# EAGLE design caffeine-hardware (EAGLE 7.7.0)
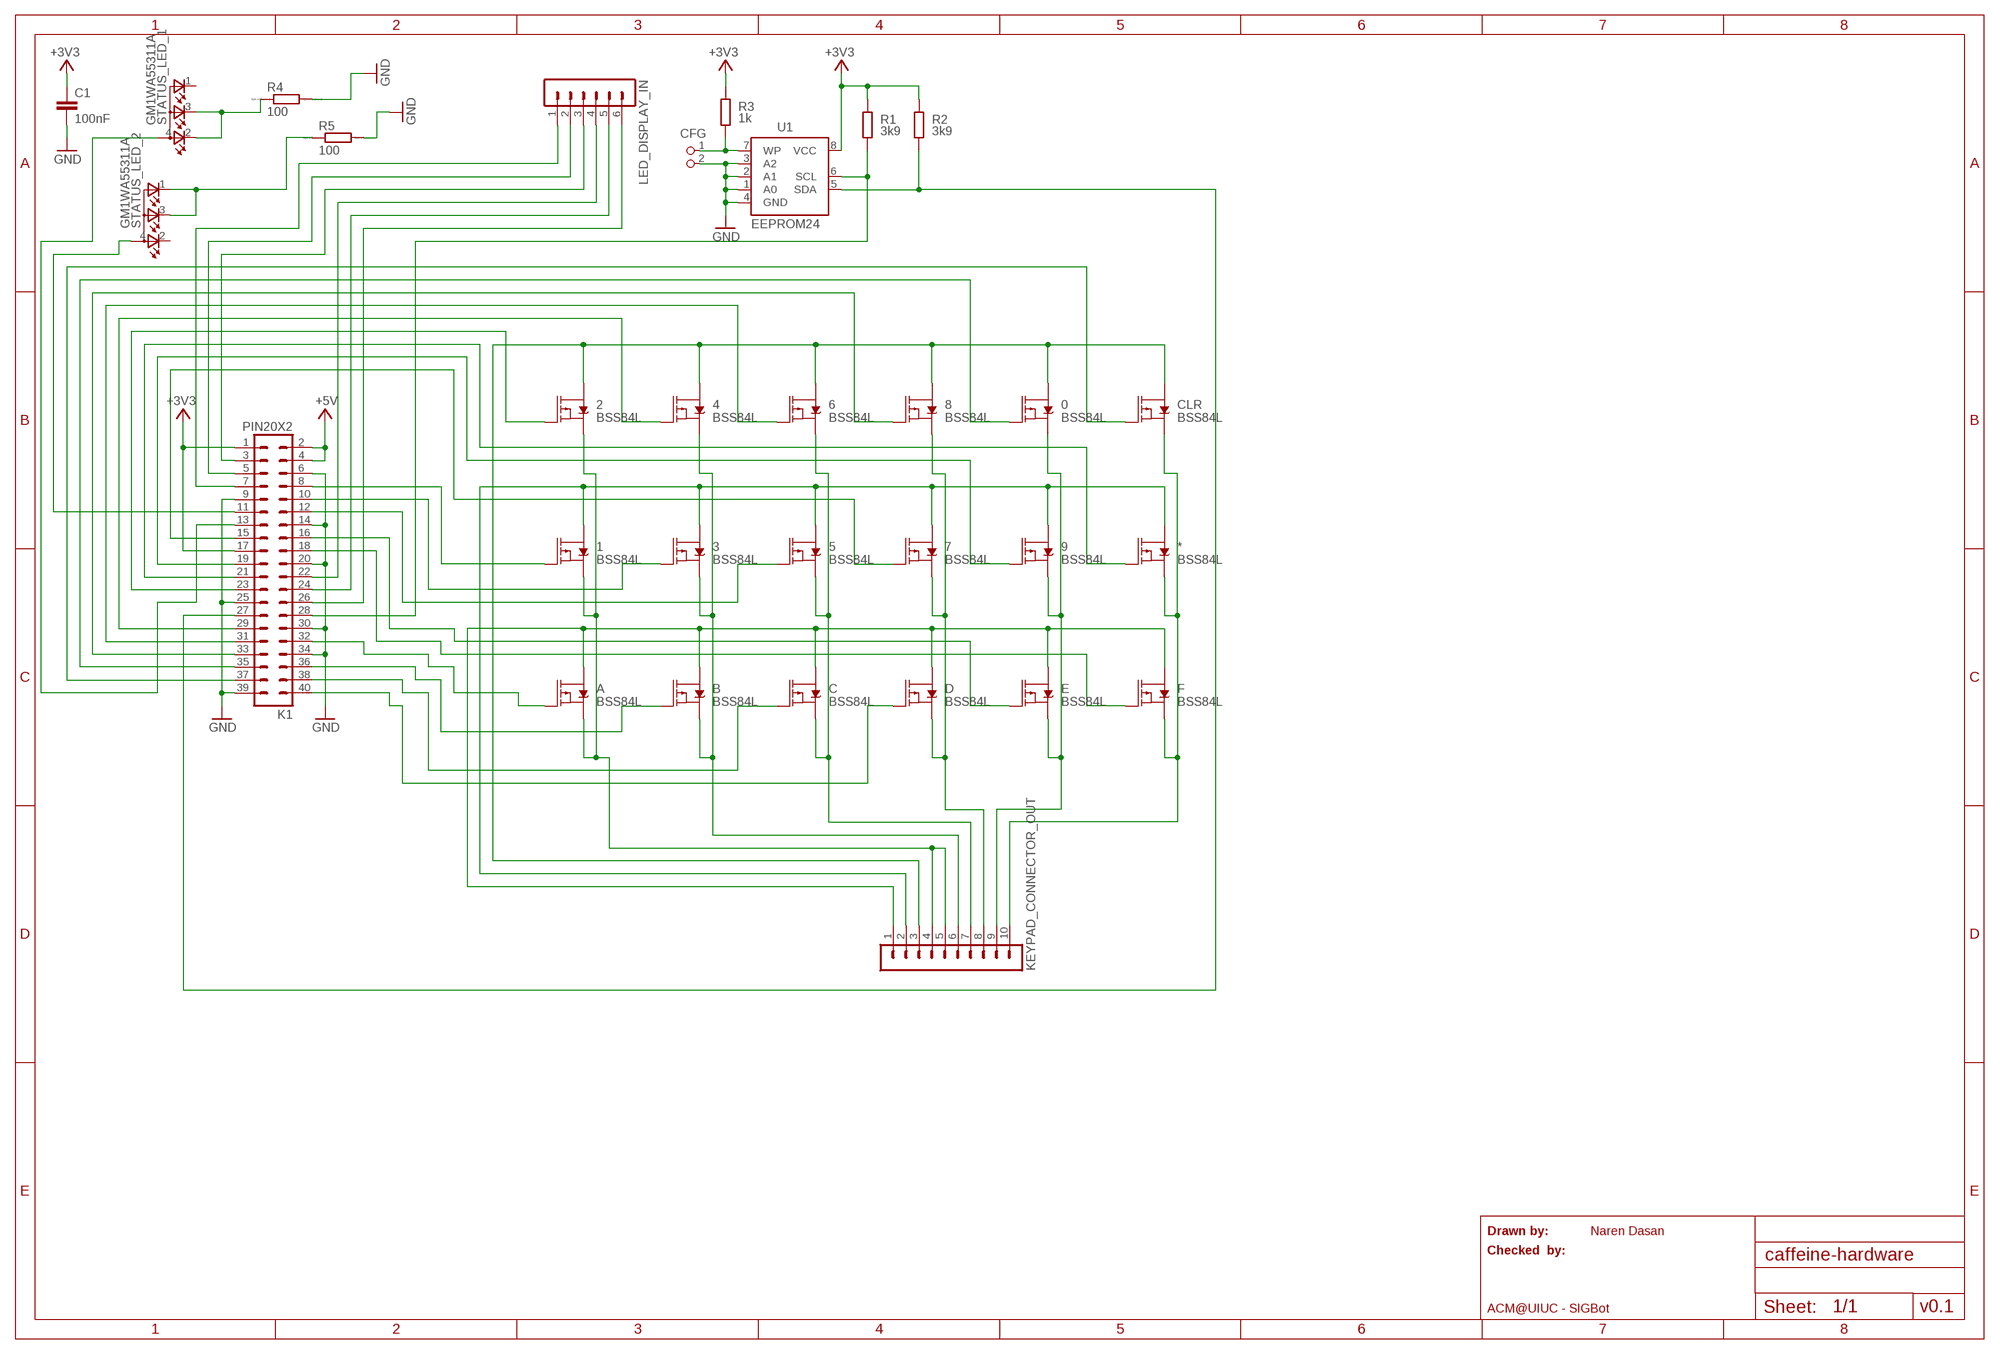
[diagram p0: schematic, sheet 1]

## Parts
0  BSS84L  MOSFET-PCH-SI2309DS  [SOT23-3]
1  BSS84L  MOSFET-PCH-SI2309DS  [SOT23-3]
2  BSS84L  MOSFET-PCH-SI2309DS  [SOT23-3]
3  BSS84L  MOSFET-PCH-SI2309DS  [SOT23-3]
4  BSS84L  MOSFET-PCH-SI2309DS  [SOT23-3]
5  BSS84L  MOSFET-PCH-SI2309DS  [SOT23-3]
6  BSS84L  MOSFET-PCH-SI2309DS  [SOT23-3]
7  BSS84L  MOSFET-PCH-SI2309DS  [SOT23-3]
8  BSS84L  MOSFET-PCH-SI2309DS  [SOT23-3]
9  BSS84L  MOSFET-PCH-SI2309DS  [SOT23-3]
*  BSS84L  MOSFET-PCH-SI2309DS  [SOT23-3]
A  BSS84L  MOSFET-PCH-SI2309DS  [SOT23-3]
B  BSS84L  MOSFET-PCH-SI2309DS  [SOT23-3]
C  BSS84L  MOSFET-PCH-SI2309DS  [SOT23-3]
C1  100nF  C-EUC0805K  [C0805K]
CFG  PIN2_100  [PIN_W_2]
CLR  BSS84L  MOSFET-PCH-SI2309DS  [SOT23-3]
D  BSS84L  MOSFET-PCH-SI2309DS  [SOT23-3]
E  BSS84L  MOSFET-PCH-SI2309DS  [SOT23-3]
F  BSS84L  MOSFET-PCH-SI2309DS  [SOT23-3]
K1  PIN20X2  [PIN_20X2]
KEYPAD_CONNECTOR_OUT  MA10-1  [MA10-1]
LED_DISPLAY_IN  MA06-1  [MA06-1]
R1  3k9  R-EU_M0805  [M0805]
R2  3k9  R-EU_M0805  [M0805]
R3  1k  R-EU_M0805  [M0805]
R4  100  R  [R0805]
R5  100  R  [R0805]
STATUS_LED_1  GM1WA55311A  [GM1WA55311A]
STATUS_LED_2  GM1WA55311A  [GM1WA55311A]
U1  EEPROM24  [SOIC8]

## Nets
+3V3: C1.1 K1.1 K1.17 R1.2 R2.2 R3.2 U1.8(VCC)
+5V: K1.2 K1.4
GND: C1.2 CFG.2 K1.6 K1.9 K1.14 K1.20 K1.25 K1.30 K1.34 K1.39 R4.2 R5.2 U1.1(A0) U1.2(A1) U1.3(A2) U1.4(GND)
N$1: K1.28 R1.1 U1.6(SCL)
N$2: K1.27 R2.1 U1.5(SDA)
N$3: CFG.1 R3.1 U1.7(WP)
N$4: A.3(D) B.3(D) C.3(D) D.3(D) E.3(D) F.3(D) KEYPAD_CONNECTOR_OUT.1
N$5: 1.3(D) 3.3(D) 5.3(D) 7.3(D) 9.3(D) *.3(D) KEYPAD_CONNECTOR_OUT.2
N$6: 0.3(D) 2.3(D) 4.3(D) 6.3(D) 8.3(D) CLR.3(D) KEYPAD_CONNECTOR_OUT.3
N$7: 5.2(S) 6.2(S) C.2(S) KEYPAD_CONNECTOR_OUT.7
N$8: CLR.1(G) K1.37
N$9: 1.2(S) 2.2(S) A.2(S) KEYPAD_CONNECTOR_OUT.4 KEYPAD_CONNECTOR_OUT.5
N$10: 7.2(S) 8.2(S) D.2(S) KEYPAD_CONNECTOR_OUT.8
N$11: 0.2(S) 9.2(S) E.2(S) KEYPAD_CONNECTOR_OUT.9
N$12: *.2(S) CLR.2(S) F.2(S) KEYPAD_CONNECTOR_OUT.10
N$13: 3.2(S) 4.2(S) B.2(S) KEYPAD_CONNECTOR_OUT.6
N$14: 0.1(G) K1.35
N$15: 8.1(G) K1.33
N$16: 6.1(G) K1.31
N$17: 4.1(G) K1.29
N$18: 2.1(G) K1.23
N$19: 7.1(G) K1.15
N$20: *.1(G) K1.21
N$21: 9.1(G) K1.19
N$22: 1.1(G) K1.8
N$23: 3.1(G) K1.10
N$24: 5.1(G) K1.12
N$25: F.1(G) K1.18
N$26: E.1(G) K1.16
N$27: A.1(G) K1.32
N$28: B.1(G) K1.36
N$29: C.1(G) K1.38
N$30: D.1(G) K1.40
N$31: K1.7 LED_DISPLAY_IN.1
N$32: K1.5 LED_DISPLAY_IN.2
N$33: K1.22 LED_DISPLAY_IN.4
N$34: K1.3 LED_DISPLAY_IN.3
N$35: K1.26 LED_DISPLAY_IN.6
N$36: K1.24 LED_DISPLAY_IN.5
N$37: K1.11 STATUS_LED_2.4(A)
N$38: K1.13 STATUS_LED_1.4(A)
N$41: R4.1 STATUS_LED_1.2(CRED) STATUS_LED_1.3(CBLUE)
N$42: R5.1 STATUS_LED_2.1(CGREEN) STATUS_LED_2.3(CBLUE)
Unconnected: STATUS_LED_1.1(CGREEN) STATUS_LED_2.2(CRED)

## Notes on the sheet
- Drawn by: | Naren Dasan
- Checked  by:
- ACM@UIUC - SIGBot | v0.1

## Library data of the parts
0 1-9 * A B C CLR D E F = SparkFun-DiscreteSemi:MOSFET-PCH: P-channel MOSFETs Voltage controlled devices that allow control of high current outputs.; PROD_ID: TRANS-08285; VALUE: 1.1A/60V/600mΩ
C1 = resistor:C-EU: CAPACITOR, European symbol; DIELECTRIC: X7R
CFG = FLYFISH:PIN2
K1 = FLYFISH:PIN20X2
KEYPAD_CONNECTOR_OUT = con-lstb:MA10-1: PIN HEADER; OC_FARNELL: unknown; OC_NEWARK: unknown
LED_DISPLAY_IN = con-lstb:MA06-1: PIN HEADER; OC_FARNELL: unknown; OC_NEWARK: unknown
R1-R3 = resistor:R-EU_: RESISTOR, European symbol; TOLERANCE: 5%
R4 R5 = eagle-ltspice:R: RESISTOR, European symbol; SPICEMODEL: NONE; SPICEPREFIX: R
STATUS_LED_1 STATUS_LED_2 = led:GM1WA55311A: Chip LED RGB Source: http://document.sharpsma.com/files/GM1WA55311A_SS.pdf
U1 = FLYFISH:EEPROM24

## Board
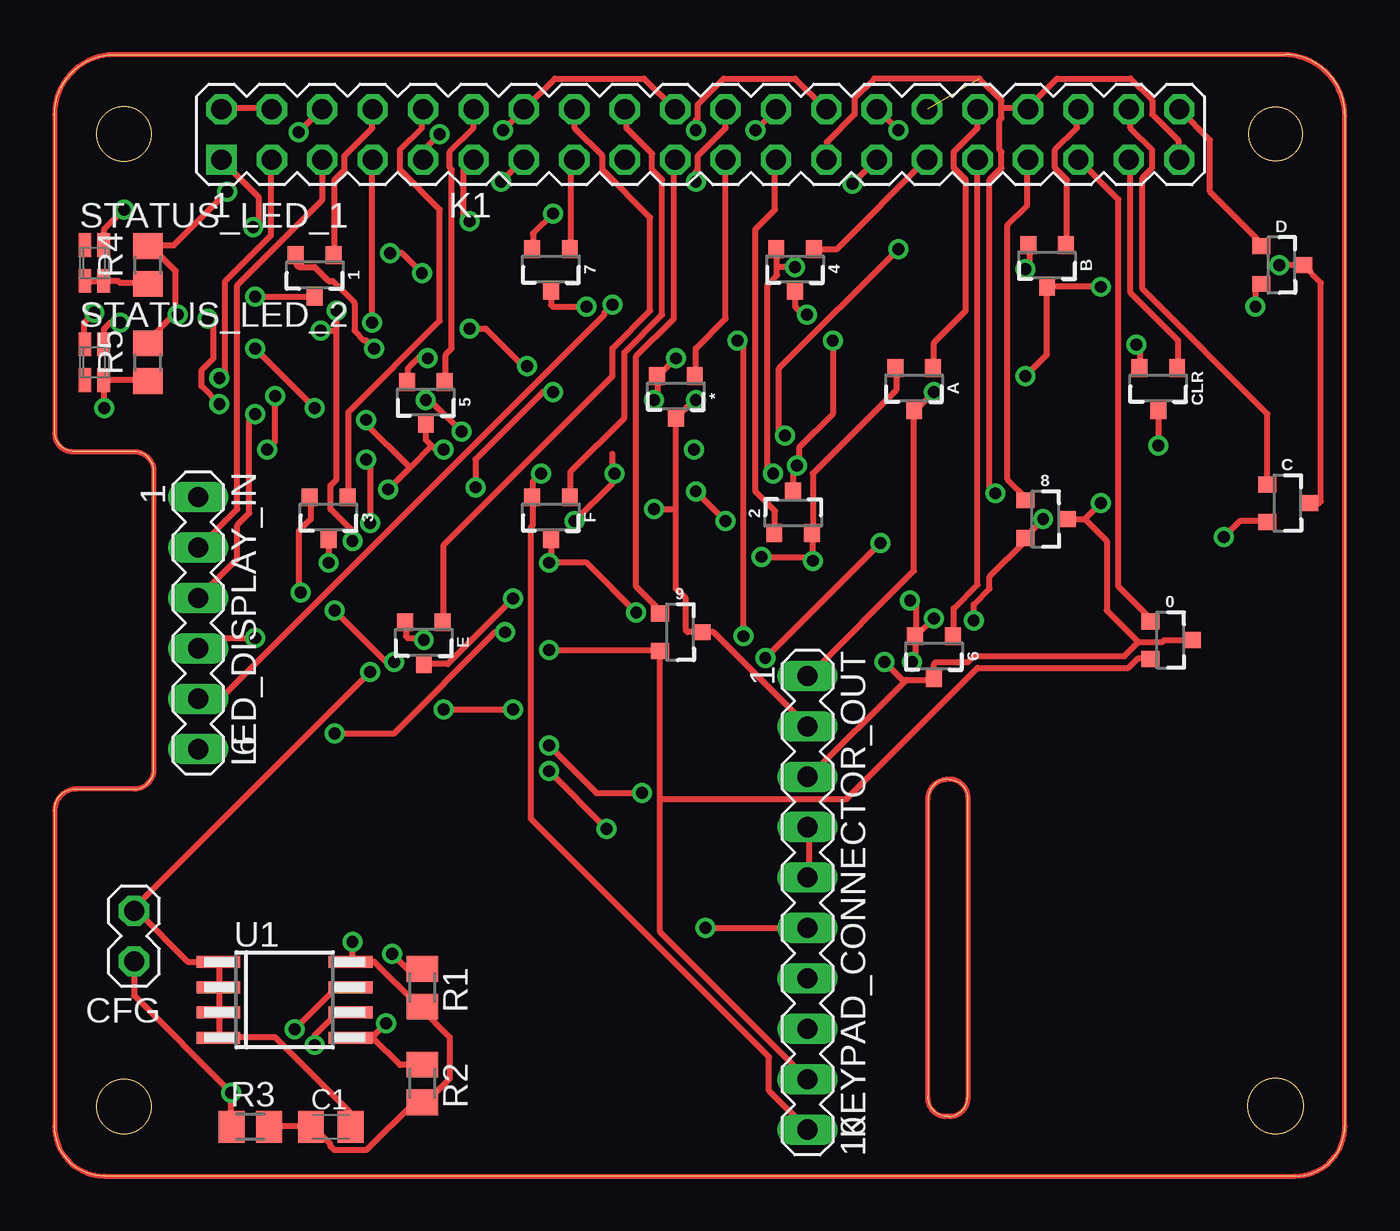
[diagram p1: board, top side]
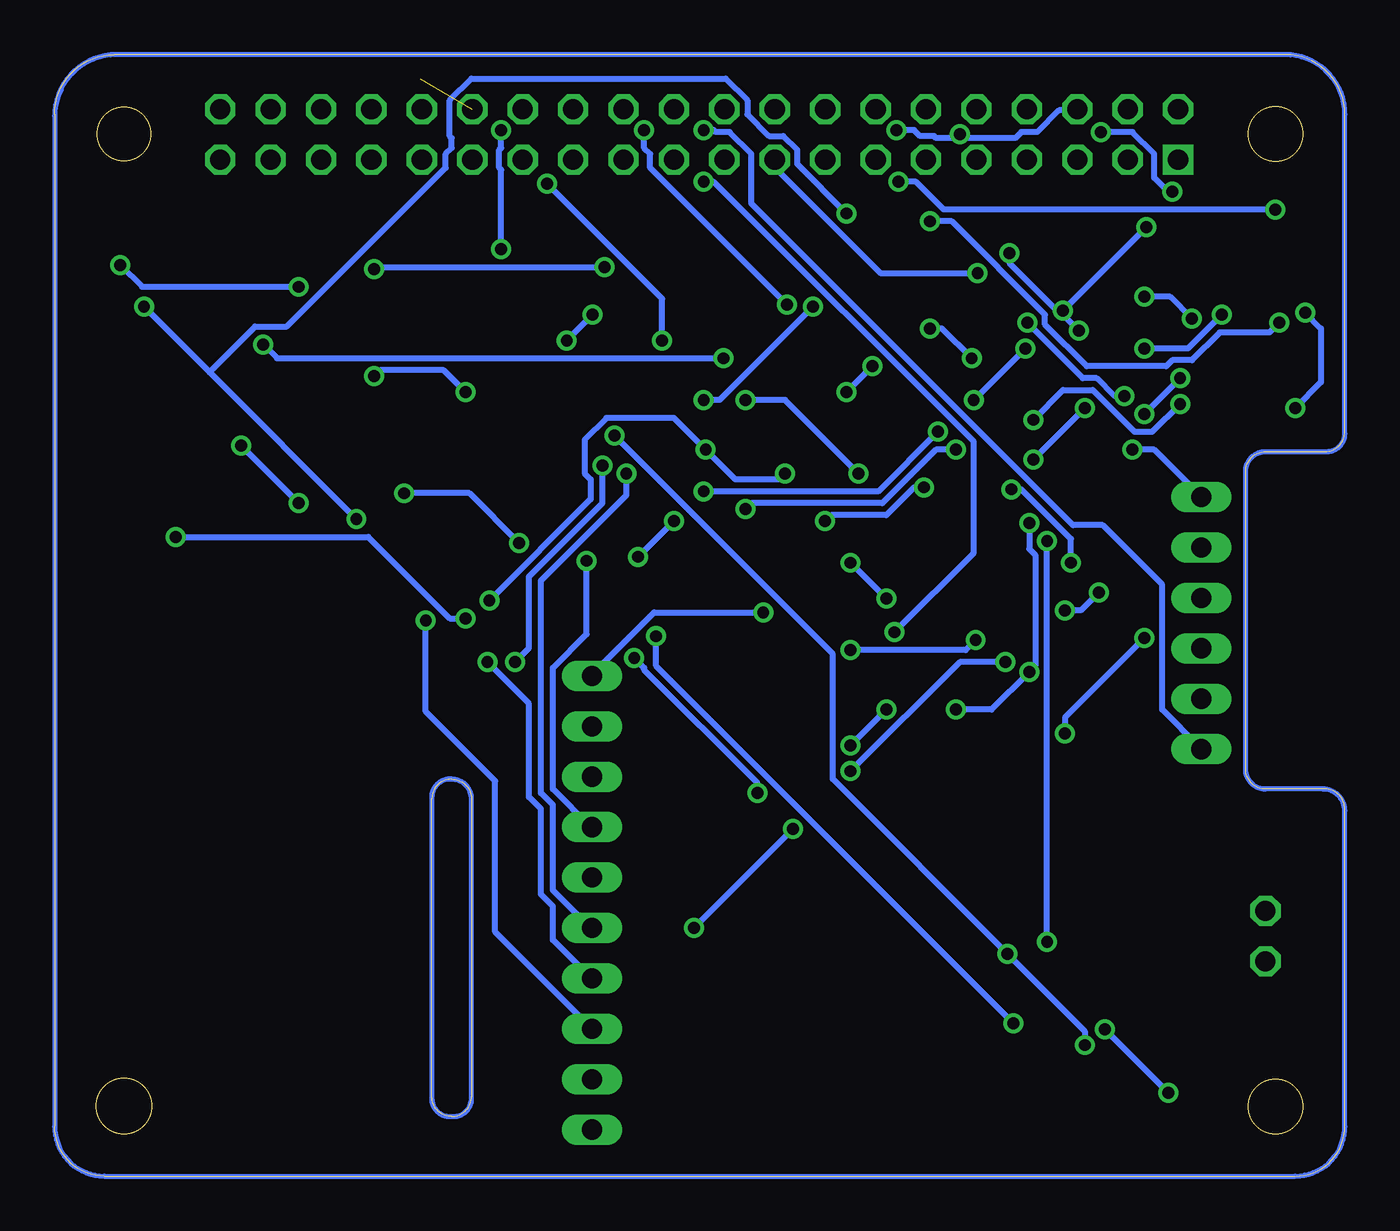
[diagram p2: board, bottom side, seen from below]

Size 65 x 56.5 mm. Coordinates in mm from the lower left corner, seen from the top.
Outline: 3,56.5 62,56.5 arc-90 65,53.5 65,2.5 arc-90 62.5,0 2.5,0 arc-90 0,2.5 0,18.5 arc-90 1,19.5 4,19.5 arc90 5,20.5 5,35.5 arc90 4,36.5 1,36.5 arc-90 0,37.5 0,53.5 arc-90 3,56.5
Outline: 46,4 46,19 arc90 45,20 arc90 44,19 44,4 arc90 45,3 arc90 46,4
Outline: circle at 3.5,3.5 radius 1.38
Outline: circle at 61.5,3.52 radius 1.4
Outline: circle at 3.5,52.5 radius 1.38
Outline: circle at 61.5,52.5 radius 1.35
Copper layers (1*16): Top 0.035mm / dielectric 1.5mm / Bottom 0.035mm
Design rules "default": minimum track width 10mil, minimum drill 24mil, track to track 8mil, track to pad 8mil, pad to pad 8mil, via to via 8mil, smd to smd 8mil, copper to edge 40mil, drill to drill 8mil, minimum pad ring 10mil, minimum via ring 8mil, stop-mask expansion 4mil, vias tented up to drill 0mil, thermal gap 10mil
tRestrict: area 0.4,0.4 to 6.6,6.6; area 0.4,49.4 to 6.6,55.6; area 58.4,49.4 to 64.6,55.6; area 58.4,0.4 to 64.6,6.6
bRestrict: area 0.4,0.4 to 6.6,6.6; area 58.4,0.4 to 64.6,6.6; area 0.4,49.4 to 6.6,55.6; area 58.4,49.4 to 64.6,55.6

### Footprints (pad centres in the part's own frame; a part is rotated, then mirrored left to right if it is on the bottom)
SOT23-3 = smd 0.8 x 0.9: 1 -0.95,-1; 2 0.95,-1; 3 0,1.1
C0805K = smd 1.3 x 1.6: 1 -1,0; 2 1,0
PIN_W_2 = drill 1.016 octagon: 1 0,0; 2 0,-2.54
PIN_20X2 = drill 1.016 square: 1 -24.13,-1.27 | drill 1.016 octagon: 2 -24.13,1.27; 3 -21.59,-1.27; 4 -21.59,1.27; 5 -19.05,-1.27; 6 -19.05,1.27; 7 -16.51,-1.27; 8 -16.51,1.27; 9 -13.97,-1.27; 10 -13.97,1.27; 11 -11.43,-1.27; 12 -11.43,1.27; 13 -8.89,-1.27; 14 -8.89,1.27; 15 -6.35,-1.27; 16 -6.35,1.27; 17 -3.81,-1.27; 18 -3.81,1.27; 19 -1.27,-1.27; 20 -1.27,1.27; 21 1.27,-1.27; 22 1.27,1.27; 23 3.81,-1.27; 24 3.81,1.27; 25 6.35,-1.27; 26 6.35,1.27; 27 8.89,-1.27; 28 8.89,1.27; 29 11.43,-1.27; 30 11.43,1.27; 31 13.97,-1.27; 32 13.97,1.27; 33 16.51,-1.27; 34 16.51,1.27; 35 19.05,-1.27; 36 19.05,1.27; 37 21.59,-1.27; 38 21.59,1.27; 39 24.13,-1.27; 40 24.13,1.27
MA10-1 = drill 1.016 long: 1 -11.43,0; 2 -8.89,0; 3 -6.35,0; 4 -3.81,0; 5 -1.27,0; 6 1.27,0; 7 3.81,0; 8 6.35,0; 9 8.89,0; 10 11.43,0
MA06-1 = drill 1.016 long: 1 -6.35,0; 2 -3.81,0; 3 -1.27,0; 4 1.27,0; 5 3.81,0; 6 6.35,0
M0805 = smd 1.3 x 1.6: 1 -0.95,0; 2 0.95,0
R0805 = smd 1.3 x 1.5: 1 -0.95,0; 2 0.95,0
GM1WA55311A = smd 0.65 x 1.2: 1 -0.475,0.9; 2 -0.475,-0.9; 3 0.475,-0.9; 4 0.475,0.9
SOIC8 = smd 0.6 x 2.2: 1 -1.905,-3.33; 2 -0.635,-3.33; 3 0.635,-3.33; 4 1.905,-3.33; 5 1.905,3.33; 6 0.635,3.33; 7 -0.635,3.33; 8 -1.905,3.33

### Placement (x,y rotation side)
0  56.2,27 270 top
1  13.1,45.4 180 top
2  37.2,33.4 0 top
3  13.8,33.2 180 top
4  37.3,45.7 180 top
5  18.7,39 180 top
6  44.3,26.2 180 top
7  25,45.7 180 top
8  49.9,33.1 270 top
9  31.5,27.4 270 top
*  31.3,39.3 180 top
A  43.3,39.7 180 top
B  50,45.9 180 top
C  62.1,33.9 270 top
C1  13.91,2.48 0 top
CFG  4,10.82 180 top
CLR  55.6,39.7 180 top
D  61.8,45.9 270 top
E  18.6,26.9 180 top
F  25,33.2 180 top
K1  32.53,52.48 0 top
KEYPAD_CONNECTOR_OUT  37.93,13.77 270 top
LED_DISPLAY_IN  7.23,27.86 270 top
R1  18.53,9.49 270 top
R2  18.53,4.67 270 top
R3  9.86,2.48 0 top
R4  4.7,45.9 90 top
R5  4.7,41 90 top
STATUS_LED_1  2,46 0 top
STATUS_LED_2  2,41 0 top
U1  11.58,8.88 270 top

### Tracks (layer width: path | path; a pad name or v marks a point on that pad's centre or on a via)
+3V3  (via drill 0.6)
  Top 0.305: R3.2 10.9,2.5 12.8,2.5 12.9,2.6 13,2.5 C1.1 13.1,2.4 13.9,1.6 13.9,1.5 14.1,1.3 15.7,1.3 18.1,3.7 18.5,3.7 R2.2 18.6,3.7 18.7,3.7 19.9,4.9 19.9,7 18.4,8.5 18.5,8.6 R1.2 18.3,8.6 16.1,10.8 15,10.8 U1.8 15,10.9 v15,11.8 | v10,47.8 10.3,48.1 10.3,49.3 K1.1 | 14.2,42.6 14.2,35.1 13.9,34.8 13.9,33.6 15,32.5 v15,32 | 14.2,42.6 v14.2,43.6 | v13.4,42.6 14.2,42.6 | v16.9,46.5 17.5,46.5 v18.5,45.5
  Bottom 0.305: v14.2,43.6 v10,47.8 | v15,11.8 v15,32 | v13.4,42.6 14.2,43.4 14.3,43.4 16.9,46 v16.9,46.5 | v18.5,45.5 23.4,45.5 28.7,50.8 28.7,51.2 K1.17
+5V
  Top 0.305: K1.2 8.4,53.8 10.9,53.8 K1.4
GND  (via drill 0.6)  (1 unrouted)
  Top 0.305: C1.2 14.9,2.5 14.9,3.2 11.1,7 8.4,7 U1.4 8.3,7 8.3,8.1 U1.3 8.3,8.3 8.3,9.4 U1.2 8.3,9.6 8.3,10.7 U1.1 8.2,10.8 6.7,10.8 4.2,13.3 4,13.3 CFG.2 4,13.5 v15.9,25.4 | 6.1,43.5 6.1,45.6 4.8,46.9 4.7,46.9 R4.2 5,46.9 6,46.9 v8.7,49.6 | 6.1,43.5 4.6,42 4.7,41.9 R5.2 | v12.3,52.6 13.4,53.7 K1.6 | v15.9,32.9 15.9,35.9 v15.7,36.1 | v10.1,41.7 v13.1,38.7 | v6.2,43.4 6.1,43.5 | v19.4,52.5 18.6,51.7 18.6,51.3 K1.9 | v22.6,52.7 23.6,53.7 K1.14 23.7,53.8 25.2,55.3 29.7,55.3 31.2,53.8 K1.20 | 47.7,53.8 47.7,53.3 47.6,53.2 47.6,51.7 47.7,51.6 47.7,50.8 47.1,50.2 47.1,34.7 v47.4,34.4 | 47.7,53.8 47.7,54.2 46.6,55.3 41.3,55.3 40.3,54.3 40.3,53.5 38.9,52.1 38.9,51.3 K1.25 | v35.8,26.1 v41.6,31.9 | v29.6,19.3 27.3,19.3 v24.9,21.7 | v19.6,23.5 v23.1,23.5 | 47.7,53.8 49,53.8 K1.34 49.1,53.9 50.5,55.3 54.2,55.3 55.3,54.2 55.3,53.5 56.6,52.2 56.6,51.3 K1.39
  Bottom 0.305: v12.3,52.6 10.7,52.6 9.6,51.5 9.6,50.3 8.9,49.6 v8.7,49.6 | v15.9,32.9 15.9,31.6 15.6,31.3 15.6,25.7 v15.9,25.4 17.8,23.5 v19.6,23.5 | v13.1,38.7 v15.7,36.1 | v10.1,41.7 7.9,41.7 v6.2,43.4 | K1.6 13.5,53.7 14.4,53.7 15.5,52.6 16.3,52.6 16.6,52.3 19.2,52.3 v19.4,52.5 19.6,52.3 20.6,52.3 20.7,52.4 21.4,52.4 21.7,52.7 v22.6,52.7 | v47.4,34.4 44.1,34.4 v41.6,31.9 | v35.8,26.1 35.3,25.6 35.3,25.5 29.6,19.8 v29.6,19.3 | v23.1,23.5 v24.9,21.7
N$1  (via drill 0.6)
  Top 0.305: v13.1,6.6 13.1,7.1 14.2,8.2 14.9,8.2 U1.6 | v17,11.2 17.8,10.4 18.5,10.4 R1.1 | v42.5,52.7 41.5,53.7 K1.28 | v42.5,46.7 36.5,40.7 36.5,37.6 v36.8,37.3
  Bottom 0.305: v13.1,6.6 13.1,7.3 v17,11.2 25.8,20 25.8,26.3 v36.8,37.3 | v42.5,52.7 42.5,51.8 42.6,51.7 42.6,50.8 42.5,50.7 v42.5,46.7
N$2  (via drill 0.6)
  Top 0.305: 16,7 15,7 U1.5 | 16,7 17.4,5.6 18.5,5.6 R2.1 | v40.2,50 41.4,51.2 K1.27 | v34.4,42.1 34.7,41.8 v34.7,27.2 | 16,7 v16.7,7.7
  Bottom 0.305: v40.2,50 34.4,44.2 v34.4,42.1 | v34.7,27.2 34.7,25.7 v16.7,7.7
N$3  (via drill 0.6)
  Top 0.305: v12.1,7.4 14.2,9.5 14.9,9.5 U1.7 | R3.1 8.9,2.5 v8.9,4.2 4,9.1 CFG.1
  Bottom 0.305: v8.9,4.2 v12.1,7.4
N$4  (via drill 0.6)
  Top 0.305: C.3 63.7,33.9 63.8,34 63.8,45 D.3 v61.7,45.9 | v52.7,44.8 B.3 50,41.4 v48.9,40.3 | KEYPAD_CONNECTOR_OUT.1 38,25.2 43.3,30.5 A.3 43.4,38.6 v44.3,39.5 | E.3 19.8,25.8 v23.1,29.1 | F.3 25,31 v24.9,30.9 26.8,30.9 v29.3,28.4
  Bottom 0.305: v52.7,44.8 60.6,44.8 v61.7,45.9 | v48.9,40.3 48.6,40.6 45.4,40.6 v44.3,39.5 | v24.9,30.9 v23.1,29.1 | v29.3,28.4 34.8,28.4 38,25.2 KEYPAD_CONNECTOR_OUT.1
N$5  (via drill 0.6)
  Top 0.305: 31.3,33.6 31.3,29.6 31.8,29.1 31.8,27.5 31.9,27.4 9.3 33.2,27.4 37.9,22.7 KEYPAD_CONNECTOR_OUT.2 | 31.3,33.6 *.3 32.2,39.1 v32.3,39.1 | v26.8,43.8 25.1,43.8 25,43.9 7.3 | v30.2,33.6 31.3,33.6 | v19.6,36.6 19.2,36.6 19,36.8 | 19,36.8 18.7,37.1 5.3 | v16.8,34.6 17.9,35.7 | 17.9,35.7 19,36.8 | 3.3 v13.8,30.9 | 17.9,35.7 15.6,38 | 15.6,38 15.5,38.1 | v10.1,44.3 1.3 | v7.7,43.2 8,42.9 8,41.2 7.4,40.6 7.4,39.8 v8.3,38.9 | v15.7,38.1 15.6,38
  Bottom 0.305: v32.3,39.1 31.5,39.1 v26.8,43.8 | v30.2,33.6 29.9,33.9 23.3,33.9 20.6,36.6 v19.6,36.6 | v16.8,34.6 16.3,34.6 3.3 v13.8,30.9 | v10.1,44.3 8.8,44.3 v7.7,43.2 | v8.3,38.9 9.7,37.5 10.6,37.5 12.7,39.6 14.2,39.6 v15.7,38.1
N$6  (via drill 0.6)
  Top 0.305: 0.3 55.9,27 55.8,26.9 54.6,26.9 | 54.6,26.9 53.9,26.2 46.3,26.2 46,25.9 44.4,25.9 44.3,25.8 6.3 44.2,25 42.9,25 42.8,24.9 | 54.6,26.9 53,28.5 53,32 51.9,33.1 | 8.3 51.9,33.1 | v52.7,33.9 51.9,33.1 | CLR.3 v55.6,36.8 | 42.8,24.9 38,20.1 KEYPAD_CONNECTOR_OUT.3 | 2.3 37.2,35.6 v37.4,35.8 37.5,35.9 37.5,36.7 39.2,38.4 v39.2,42.1 | 42.8,24.9 v41.8,25.9 | v37.9,43.4 37.7,43.4 37.3,43.8 4.3
  Bottom 0.305: v55.6,36.8 v52.7,33.9 | v37.4,35.8 37.4,33.9 41.1,30.2 41.1,26.6 v41.8,25.9 | v37.9,43.4 v39.2,42.1
N$7  (via drill 0.6)
  Top 0.305: v43.2,25.9 43.4,26.1 43.4,27.2 6.2 | v44.3,28.1 43.5,27.3 6.2 | v58.9,32.2 59.7,33 61.1,33 C.2 | 5.2 17.8,40 17.8,40.7 18.4,41.3 18.8,41.3 v18.8,41.2 | v20.9,42.7 21.7,42.7 23.7,40.7 23.8,40.7 | 23.8,40.7 23.9,40.7 | v23.8,40.8 23.8,40.7 | 28.1,35.4 28.1,34.9 v26.2,33 | 28.1,35.4 28.1,36.4 | v21.2,34.7 21.2,36.1 24.6,39.5 v25.1,39.5 | v32.2,36.6 32.5,36.6 | v28.2,35.4 28.1,35.4 | v43.1,29 43.4,28.7 43.4,27.6 43.5,27.5 6.2
  Bottom 0.305: v43.2,25.9 41.1,23.8 41.1,19.1 40.5,18.5 40.5,14.2 39.9,13.6 39.9,11.9 38,10 KEYPAD_CONNECTOR_OUT.7 | v44.3,28.1 45.1,28.1 49.2,32.2 v58.9,32.2 | v20.9,42.7 20.3,42.7 v18.8,41.2 | v23.8,40.8 v25.1,39.5 | v26.2,33 25.9,33.3 23.1,33.3 21.7,34.7 v21.2,34.7 | v28.2,35.4 28.5,35.1 30.7,35.1 v32.2,36.6 33.8,38.2 37.2,38.2 38.3,37.1 38.3,35.4 38,35.1 38,34.1 v43.1,29
N$8
  Top 0.305: K1.37 54.2,51.2 54.2,44.5 56.6,42.1 56.6,40.7 CLR.1
N$9  (via drill 0.6)
  Top 0.305: KEYPAD_CONNECTOR_OUT.5 38,15.1 38,17.5 KEYPAD_CONNECTOR_OUT.4 | A.2 42.4,40.7 42.4,39.6 38.2,35.4 38.2,32.5 2.2 38.2,32.4 v38.2,31 38.1,31.2 v35.6,31.2 | v32.3,34.5 v33.8,33 | v20.5,37.5 18.9,39.1 v18.7,39.1 | v16.1,41.7 15.7,42.1 15.6,42.1 15.1,42.6 15.1,44 14,45.1 13.8,45.1 13.1,45.8 12.3,45.8 12.2,45.9 12.2,46.4 1.2
  Bottom 0.305: v38.2,31 38.2,27.3 39.9,25.6 39.9,19.5 38,17.6 KEYPAD_CONNECTOR_OUT.4 | v33.8,33 v35.6,31.2 | v32.3,34.5 23.5,34.5 v20.5,37.5 | v16.1,41.7 v18.7,39.1
N$10  (via drill 0.6)
  Top 0.305: v49.8,33.1 48.9,32.2 8.2 48.9,32 47.1,30.2 47.1,29.6 46.3,28.8 v46.3,28 | v60.5,43.8 60.5,44.6 60.8,44.9 D.2 | v25.1,48.5 24.1,47.5 24.1,46.7 7.2
  Bottom 0.305: v60.5,43.8 57.2,40.5 | 57.2,40.5 v49.8,33.1 | v46.3,28 46.3,23.4 42.8,19.9 42.8,12.3 38,7.5 KEYPAD_CONNECTOR_OUT.8 | v25.1,48.5 27.6,51 27.6,51.7 28.3,52.4 29,52.4 30.1,53.5 30.1,54.2 31.2,55.3 44,55.3 45.1,54.2 45.1,52.4 45,52.3 45,51.8 45.3,51.5 45.3,50.8 53.3,42.8 54.9,42.8 57.2,40.5
N$11  (via drill 0.6)
  Top 0.305: 30.5,19 30.5,12.3 37.9,4.9 KEYPAD_CONNECTOR_OUT.9 | 30.5,19 9.2 30.4,26.5 v24.9,26.5 | v18.6,27 18.5,27.1 17.8,27.1 17.7,27.2 17.7,27.9 E.2 | 30.5,19 39.9,19 46.5,25.6 54.1,25.6 54.6,26.1 55.2,26.1 0.2
  Bottom 0.305: v24.9,26.5 19.1,26.5 v18.6,27
N$12  (via drill 0.6)
  Top 0.305: v30.2,39.1 30.4,39.3 30.4,40.3 *.2 30.5,40.4 v31.3,41.2 | v24.5,35.4 24.1,35 24.1,34.2 F.2 24.1,34.1 24.1,32.8 24,32.7 24,18 36,6 36,4.3 37.9,2.4 KEYPAD_CONNECTOR_OUT.10 | v54.5,41.9 54.7,41.7 54.7,40.7 CLR.2
  Bottom 0.305: v30.2,39.1 28.2,39.1 v24.5,35.4 | v31.3,41.2 53.8,41.2 v54.5,41.9
N$13  (via drill 0.6)
  Top 0.305: 36.4,45.8 36.4,45.4 35.9,44.9 35.9,35.7 v36.2,35.4 | 36.4,45.8 36.4,46.7 4.2 | v37.3,45.8 36.4,45.8 | v48.9,45.7 49.1,45.9 49.1,46.9 B.2 | 12.3,29.4 12.3,32.5 12.9,33.1 12.9,34.2 3.2 | 12.3,29.4 12.3,29.2 | v32.8,12.5 KEYPAD_CONNECTOR_OUT.6 | v24.9,20.4 v27.8,17.5 | v17.1,25.9 16.7,25.9 v14.1,28.5 | v12.4,29.4 12.3,29.4
  Bottom 0.305: v36.2,35.4 36.2,34.3 40.5,30 40.5,19.3 39.9,18.7 39.9,14.4 38,12.5 KEYPAD_CONNECTOR_OUT.6 | v37.3,45.8 48.8,45.8 v48.9,45.7 | v27.8,17.5 v32.8,12.5 | v24.9,20.4 19.4,25.9 v17.1,25.9 | v14.1,28.5 13.3,28.5 v12.4,29.4
N$14
  Top 0.305: K1.35 51.6,51.2 53.6,49.2 53.6,29.7 55.3,28 55.2,27.9 0.1
N$15
  Top 0.305: K1.33 49,51.2 49,48.9 48,47.9 48,35.1 49,34.1 48.9,34 8.1
N$16
  Top 0.305: K1.31 46.5,29.8 45.3,28.6 45.3,27.2 6.1
N$17
  Top 0.305: K1.29 43.9,51.2 39.4,46.7 38.4,46.7 38.3,46.6 38.2,46.7 4.1
N$18
  Top 0.305: K1.23 36.3,51.2 36.3,48.7 35.3,47.7 35.3,34.5 36.3,33.5 36.3,32.4 2.1
N$19
  Top 0.305: 7.1 26,46.7 26,51.1 26.1,51.2 K1.15
N$20
  Top 0.305: K1.21 33.8,43.2 32.3,41.7 32.3,40.3 *.1
N$21
  Top 0.305: K1.19 31.2,51.2 31.2,43.2 29.3,41.3 29.3,29.7 30.6,28.4 30.5,28.3 9.1
N$22
  Top 0.305: K1.8 16,53.7 16,52.8 14.6,51.4 14.6,50.7 14.1,50.2 14.1,46.4 1.1
N$23
  Top 0.305: K1.10 18.5,53.7 18.5,52.8 17.4,51.7 17.4,50.7 19.4,48.7 19.4,43.1 14.8,38.5 14.8,34.2 3.1
N$24
  Top 0.305: K1.12 21.1,52.8 19.9,51.6 19.9,50.8 20,50.7 20,41.7 19.7,41.4 19.7,40 5.1
N$25
  Top 0.305: K1.18 28.8,53.7 28.8,52.8 30.1,51.5 30.1,50.7 30.6,50.2 30.6,43.4 28.7,41.5 28.7,38.2 26,35.5 26,34.2 F.1
N$26
  Top 0.305: K1.16 26.2,53.7 26.2,52.8 27.6,51.4 27.6,50.7 30,48.3 30,43.6 28.1,41.7 28.1,40.3 19.6,31.8 19.6,27.9 E.1
N$27
  Top 0.305: K1.32 46.5,52.8 45.3,51.6 45.3,50.8 45.9,50.2 45.9,43.6 44.3,42 44.3,40.7 A.1
N$28
  Top 0.305: K1.36 51.5,53.7 51.5,52.8 50.4,51.7 50.4,50.8 51,50.2 51,46.9 B.1
N$29
  Top 0.305: K1.38 54.2,53.7 54.2,52.8 55.3,51.7 55.3,50.8 54.8,50.3 54.8,44.7 61.1,38.4 61.1,35 61.2,34.9 61.1,34.8 C.1
N$30
  Top 0.305: K1.40 56.7,53.7 58.2,52.2 58.2,49.6 60.9,46.9 60.8,46.8 D.1
N$31  (via drill 0.6)
  Top 0.305: v16,43 16,51.2 K1.7 | v11.1,39.3 11.1,37 v10.7,36.6
  Bottom 0.305: v16,43 13.2,40.2 12.5,40.2 11.6,39.3 v11.1,39.3 | v10.7,36.6 9.6,36.6 7.3,34.3 LED_DISPLAY_IN.1
N$32
  Top 0.305: K1.5 13.5,51.2 13.5,49.2 9.2,44.9 9.2,33.6 7.3,31.7 LED_DISPLAY_IN.2
N$33  (via drill 0.6)
  Top 0.305: K1.22 33.8,52.8 32.4,51.4 32.4,50.7 32.3,50.6 v32.3,50.1 | v22.7,27.4 22.2,27.4 17.1,22.3 v14.1,22.3 | v10.1,27.1 7.8,27.1 7.3,26.6 LED_DISPLAY_IN.4
  Bottom 0.305: v32.3,50.1 31.8,50.1 18.7,37 18.7,31.4 v22.7,27.4 | v14.1,22.3 14.1,23.1 v10.1,27.1
N$34  (via drill 0.6)
  Top 0.305: v8.3,40.2 8.6,40.5 8.6,45.1 10.9,47.4 10.9,51.2 K1.3 | v10.1,38.4 9.8,38.1 9.8,33.4 9.2,32.8 9.2,31.1 LED_DISPLAY_IN.3
  Bottom 0.305: v10.1,38.4 v8.3,40.2
N$35  (via drill 0.6)
  Top 0.305: v32.3,52.7 32.3,53.2 32.4,53.3 32.4,54 33.7,55.3 37.3,55.3 38.8,53.8 K1.26
  Bottom 0.305: v32.3,52.7 31.8,52.7 31.7,52.6 31,52.6 29.9,51.5 29.9,49 13.7,32.8 12.2,32.8 9.2,29.8 9.2,23.5 7.3,21.6 LED_DISPLAY_IN.6
N$36  (via drill 0.6)
  Top 0.305: v35.3,52.7 36.3,53.7 K1.24 | v28.1,43.9 27.7,43.5 27.7,43.4 8.4,24.1 7.3,24.1 LED_DISPLAY_IN.5
  Bottom 0.305: v35.3,52.7 35.3,51.8 35,51.5 35,50.8 v28.1,43.9
N$37  (via drill 0.6)
  Top 0.305: v20.9,48.1 20.6,48.4 20.6,50.7 K1.11 | v3.3,43 2.8,43 2.5,42.7 2.5,41.9 STATUS_LED_2.4
  Bottom 0.305: v20.9,48.1 19.8,48.1 15.1,43.4 15.1,42.9 13,40.8 9,40.8 8.7,41.1 7.7,41.1 6.3,42.5 3.8,42.5 v3.3,43
N$38  (via drill 0.6)
  Top 0.305: v22.5,50.1 23.6,51.2 K1.13 | v3.5,48.7 2.5,47.7 2.5,46.9 STATUS_LED_1.4
  Bottom 0.305: v22.5,50.1 21.6,50.1 20.2,48.7 v3.5,48.7
N$39
  Top 0.254: 44,3.9 44,19 arc-90 45,20 45.1,20 arc-90 46,19.1 46,3.9 arc-90 45.1,3 44.9,3 arc-90 44,3.9
  Bottom 0.254: 44,3.7 44,3.9 | 44,3.9 44,19 arc-90 45,20 45.1,20 arc-90 46,19.1 46,3.9 arc-90 45.1,3 44.9,3 arc-90 44,3.9
N$40
  Top 0.254: 1,36.5 4,36.5 arc-90 5,35.5 5,20.5 arc-90 4,19.5 1.1,19.5 arc90 0,18.4 0,2.5 arc90 2.5,0 62.5,0 arc90 65,2.5 65,53.4 arc90 61.9,56.5 3,56.5 arc90 0,53.5 0,37.4 arc90 0.9,36.5
  Bottom 0.254: 2.5,0 arc-90 0,2.5 0,18.4 arc-90 1.1,19.5 4,19.5 arc90 5,20.5 5,35.5 arc90 4,36.5 0.9,36.5 arc-90 0,37.4 0,53.5 arc-90 3,56.5 61.9,56.5 arc-90 65,53.4 65,2.5 arc-90 62.5,0 2.5,0
N$41
  Top 0.305: R4.1 4.7,45 3.3,45 3.2,45.1 STATUS_LED_1.3 STATUS_LED_1.2
N$42  (via drill 0.6)
  Top 0.305: R5.1 4.7,40.1 STATUS_LED_2.3 2.5,40 v2.5,38.7 | v2,43.5 1.5,43 1.5,41.9 STATUS_LED_2.1
  Bottom 0.305: v2.5,38.7 1.2,40 1.2,42.7 v2,43.5